# Altium schematic sheet Motor.SchDoc: SysP17_Team10: Motoren
size A4; CheckedBy: U. Hauser; Author: N. Dürr / M. Mettler; CompanyName: NTB; Organization: NTB Interstate University of Applied; Address1: Werdenbergstrasse 4; Address3: 9471 Buchs; Address4: Switzerland; SheetNumber: 5; SheetTotal: 5; Organization1: Sciences of Technology Buchs; Size: A4; ShortDescription: Schema der Motoren-Schaltung
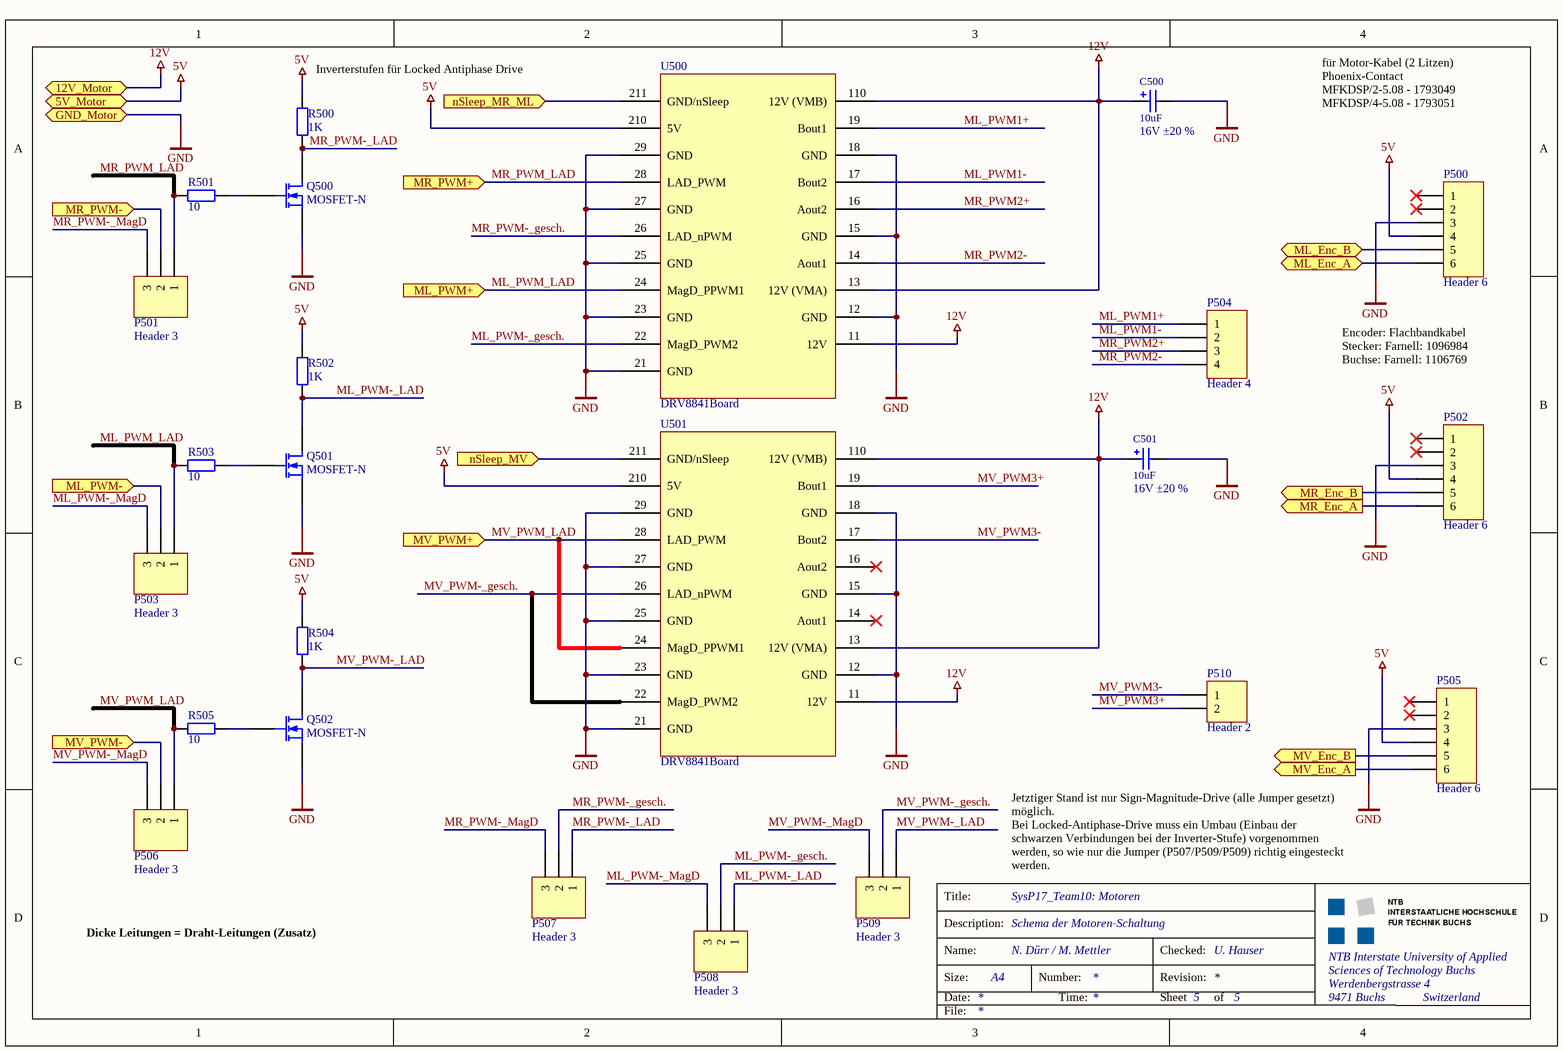
[diagram p0: Motor.SchDoc]

## Parts
C500  value 10uF  ValueAddon: 16V ±20 %  [CDE_CAP AVE CODE D_H]  (hidden comment: AVE476M16D16T-F)
C501  value 10uF  ValueAddon: 16V ±20 %  [CDE_CAP AVE CODE D_H]  (hidden comment: AVE476M16D16T-F)
P500  Header 6  [HDR2X3]
P501  Header 3  [HDR1X3]
P502  Header 6  [HDR2X3]
P503  Header 3  [HDR1X3]
P504  Header 4  [Connector_4Header]
P505  Header 6  [HDR2X3]
P506  Header 3  [HDR1X3]
P507  Header 3  [HDR1X3]
P508  Header 3  [HDR1X3]
P509  Header 3  [HDR1X3]
P510  Header 2  [Connector_2Header]
Q500  MOSFET-N  [SOT23-3]
Q501  MOSFET-N  [SOT23-3]
Q502  MOSFET-N  [SOT23-3]
R500  value 1K  [GEN_R0805_H]  (hidden comment: Generic)
R501  value 10  [GEN_R0805_H]  (hidden comment: Generic)
R502  value 1K  [GEN_R0805_H]  (hidden comment: Generic)
R503  value 10  [GEN_R0805_H]  (hidden comment: Generic)
R504  value 1K  [GEN_R0805_H]  (hidden comment: Generic)
R505  value 10  [GEN_R0805_H]  (hidden comment: Generic)
U500  DRV8841Board  [DRV8841_Board]
U501  DRV8841Board  [DRV8841_Board]

## Ports
5V_Motor, 12V_Motor, GND_Motor, ML_Enc_A, ML_Enc_B, ML_PWM+ (in), ML_PWM- (in), MR_Enc_A (out), MR_Enc_B (out), MR_PWM+ (in), MR_PWM- (in), MV_Enc_A (out), MV_Enc_B (out), MV_PWM+ (in), MV_PWM- (in), nSleep_MR_ML (in), nSleep_MV (in)

## Nets
5V: P500.4 P502.4 P505.4 R500.2 R502.2 R504.2 U500.210(5V) U501.210(5V) ; port 5V_Motor
12V: C500.1(Pos) C501.1(Pos) U500.11(12V) U500.13(12V_(VMA)) U500.110(12V_(VMB)) U501.11(12V) U501.13(12V_(VMA)) U501.110(12V_(VMB)) ; port 12V_Motor
GND: C500.2(Neg) C501.2(Neg) P500.3 P502.3 P505.3 Q500.2(S) Q501.2(S) Q502.2(S) U500.12(GND) U500.15(GND) U500.18(GND) U500.21(GND) U500.23(GND) U500.25(GND) U500.27(GND) U500.29(GND) U501.12(GND) U501.15(GND) U501.18(GND) U501.21(GND) U501.23(GND) U501.25(GND) U501.27(GND) U501.29(GND) ; port GND_Motor
ML_Enc_A: P500.6 ; port ML_Enc_A
ML_Enc_B: P500.5 ; port ML_Enc_B
ML_PWM1+: P504.1 U500.19(Bout1)
ML_PWM1-: P504.2 U500.17(Bout2)
ML_PWM-: P503.2 ; port ML_PWM-
ML_PWM-_gesch.: P508.2 U500.22(MagD_PWM2)
ML_PWM-_LAD: P508.1 Q501.3(D) R502.1
ML_PWM-_MagD: P503.3 P508.3
ML_PWM_LAD: P503.1 R503.2 U500.24(MagD_PPWM1) ; port ML_PWM+
MR_Enc_A: P502.6 ; port MR_Enc_A
MR_Enc_B: P502.5 ; port MR_Enc_B
MR_PWM2+: P504.3 U500.16(Aout2)
MR_PWM2-: P504.4 U500.14(Aout1)
MR_PWM-: P501.2 ; port MR_PWM-
MR_PWM-_gesch.: P507.2 U500.26(LAD_nPWM)
MR_PWM-_LAD: P507.1 Q500.3(D) R500.1
MR_PWM-_MagD: P501.3 P507.3
MR_PWM_LAD: P501.1 R501.2 U500.28(LAD_PWM) ; port MR_PWM+
MV_Enc_A: P505.6 ; port MV_Enc_A
MV_Enc_B: P505.5 ; port MV_Enc_B
MV_PWM3+: P510.2 U501.19(Bout1)
MV_PWM3-: P510.1 U501.17(Bout2)
MV_PWM-: P506.2 ; port MV_PWM-
MV_PWM-_gesch.: P509.2 U501.22(MagD_PWM2) U501.26(LAD_nPWM)
MV_PWM-_LAD: P509.1 Q502.3(D) R504.1
MV_PWM-_MagD: P506.3 P509.3
MV_PWM_LAD: P506.1 R505.2 U501.24(MagD_PPWM1) U501.28(LAD_PWM) ; port MV_PWM+
nSleep_MR_ML: U500.211(GND/nSleep) ; port nSleep_MR_ML
nSleep_MV: U501.211(GND/nSleep) ; port nSleep_MV
NetQ500_1: Q500.1(G) R501.1
NetQ501_1: Q501.1(G) R503.1
NetQ502_1: Q502.1(G) R505.1

Not connected (* = marked no-connect by the designer): P500 1* 2*; P502 1* 2*; P505 1* 2*; U501 14(Aout1)* 16(Aout2)*

## Notes on the sheet
- (near R500) Inverterstufen für Locked Antiphase Drive
- für Motor-Kabel (2 Litzen)
  Phoenix-Contact
  MFKDSP/2-5.08 - 1793049
  MFKDSP/4-5.08 - 1793051
- Encoder: Flachbandkabel
  Stecker: Farnell: 1096984
  Buchse: Farnell: 1106769
- Dicke Leitungen = Draht-Leitungen (Zusatz)
- Jetztiger Stand ist nur Sign-Magnitude-Drive (alle Jumper gesetzt) möglich.
  Bei Locked-Antiphase-Drive muss ein Umbau (Einbau der schwarzen Verbindungen bei der Inverter-Stufe) vorgenommen werden, so wie nur die Jumper (P507/P509/P509) richtig eingesteckt werden.
- Title:
- Description:
- Size:
- Date:
- Name:
- Number:
- Time:
- Revision:
- Sheet
- Checked:
- of
- File:

## Library data of the parts
C500 C501 = CDE_AVE476M16D16T-F_AVE CODE D: Aluminum Electrolytic Capacitors for Filtering and Bypass, 47uF, 16V; Manufacturer: Cornell Dubilier; #Class: PASSIVE; RefFootprint: CDE_CAP AVE CODE D; #ClassSub: CAPACITOR; Distributor PartNr: 598-AVE476M16D16T-F; Distributor: Mouser; Published: 20121220; Publisher: Stefan Ursella, M.Eng; ComponentLink1Description: Manufacturer Link; ComponentLink2Description: Datasheet; ComponentLink2URL: http://www.cde.com/catalogs/AVE.pdf; ComponentLink3Description: Packaging Specification; Manufacturer PartNr: AVE476M16D16T-F; RefFileFOO: *; RefFileSCH: *; RefSchema: CDE_AVE476M16D16T-F_AVE CODE D
P500 P502 P505 = Header 6: Header, 6-Pin; LatestRevisionDate: 17-Jul-2002; LatestRevisionNote: Re-released for DXP Platform.; Publisher: Altium Limited
P501 P503 P506-P509 = Header 3: Header, 3-Pin; LatestRevisionDate: 17-Jul-2002; LatestRevisionNote: Re-released for DXP Platform.; Publisher: Altium Limited
P504 = Header 4: Header, 4-Pin; LatestRevisionDate: 17-Jul-2002; LatestRevisionNote: Re-released for DXP Platform.; Publisher: Altium Limited
P510 = Header 2: Header, 2-Pin; LatestRevisionDate: 17-Jul-2002; LatestRevisionNote: Re-released for DXP Platform.; Publisher: Altium Limited
Q500-Q502 = MOSFET-N: N-Channel MOSFET; Published: 8-Jun-2000; LatestRevisionDate: 17-Jul-2002; LatestRevisionNote: Re-released for DXP Platform.; PackageVersion: 1995/1996; PackageReference: E3; Publisher: Altium Limited; PackageDescription: TO, Flat Index; 3 In-Line, Axial Leads; Body Dia. 4.6mm; Lead Dia. 0.5 mm (max)
R500-R505 = GEN_R_2: generic resistor; Manufacturer: Tbd; #Class: PASSIVE; Published: 8-Jun-2000; Publisher: Altium Limited; #ClassSub: RESISTOR; ComponentLink1Description: Manufacturer Link; ComponentLink2Description: Datasheet; ComponentLink3Description: Packaging Specification; Distributor: tbd; RefFootprint: GEN_R0805_H; Manufacturer PartNr: tbd; Distributor PartNr: tbd; RefFileFOO: *; RefFileSCH: *; RefSchema: GEN_R_2
U500 U501 = DRV8841_Board